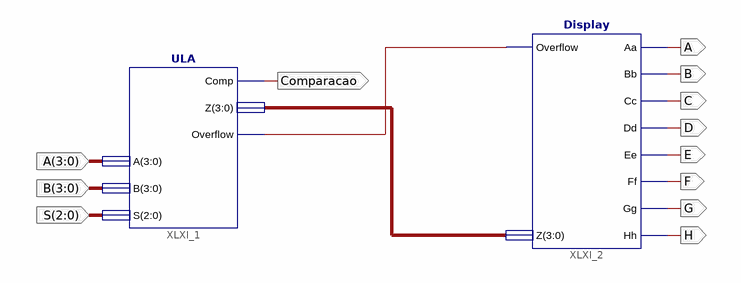
[diagram p0: schematic sheet 1]
// Xilinx ISE schematic ULACompleta.sch (xa9500xl) as structural Verilog: 2 symbols, 12 ports
module ULACompleta (
  input  [3:0] A,
  input  [3:0] B,
  input  [2:0] S,
  output Comparacao,
  output A_1bit,
  output B_1bit,
  output C,
  output D,
  output E,
  output F,
  output G,
  output H
);

  wire XLXN_1;
  wire [3:0] XLXN_2;

  ULA XLXI_1 (.A(A), .B(B), .S(S), .Z(XLXN_2), .Overflow(XLXN_1), .Comp(Comparacao));
  Display XLXI_2 (
    .Overflow(XLXN_1), .Z(XLXN_2), .Aa(A_1bit), .Bb(B_1bit), .Cc(C), .Dd(D), .Ee(E), .Ff(F), .Gg(G), .Hh(H));
endmodule
